# Altium schematic sheet uC_Essentials.SchDoc
size A4; SheetNumber: 5; SheetTotal: 13
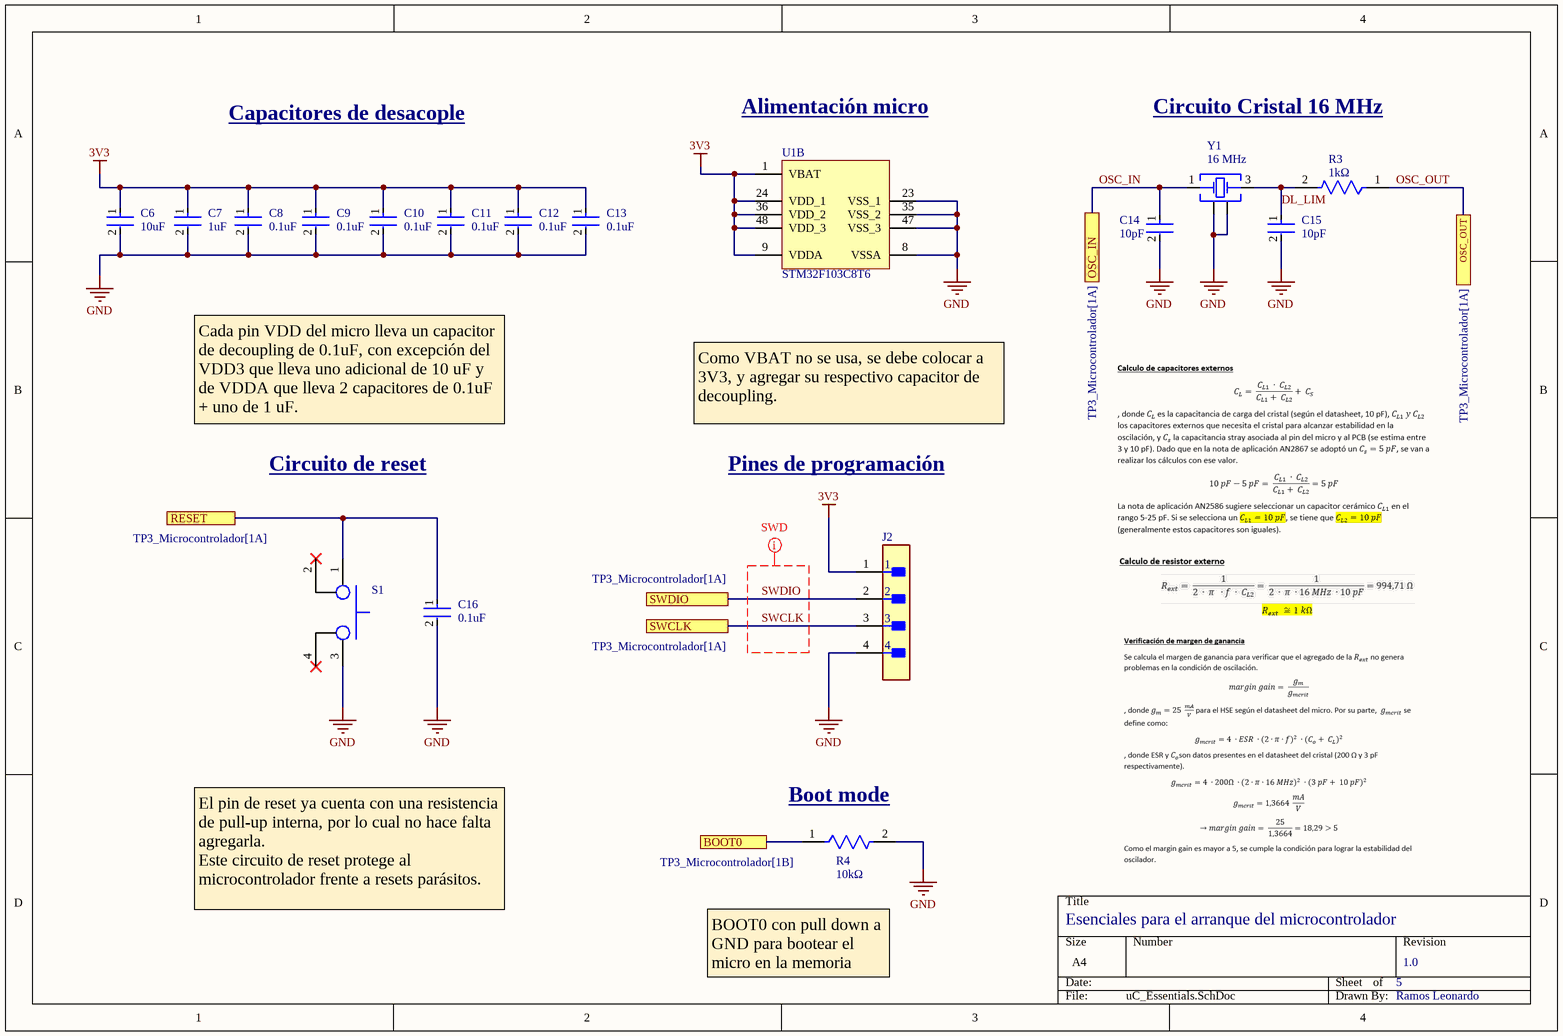
[diagram p0: uC_Essentials.SchDoc]

## Parts
C6  value 10uF  [FP-CC0805-0_85-MFG]  (hidden comment: CC0805KRX7R8BB104)
C7  value 1uF  [FP-CC0805-0_85-MFG]  (hidden comment: CC0805KRX7R8BB104)
C8  value 0.1uF  [FP-CC0805-0_85-MFG]  (hidden comment: CC0805KRX7R8BB104)
C9  value 0.1uF  [FP-CC0805-0_85-MFG]  (hidden comment: CC0805KRX7R8BB104)
C10  value 0.1uF  [FP-CC0805-0_85-MFG]  (hidden comment: CC0805KRX7R8BB104)
C11  value 0.1uF  [FP-CC0805-0_85-MFG]  (hidden comment: CC0805KRX7R8BB104)
C12  value 0.1uF  [FP-CC0805-0_85-MFG]  (hidden comment: CC0805KRX7R8BB104)
C13  value 0.1uF  [FP-CC0805-0_85-MFG]  (hidden comment: CC0805KRX7R8BB104)
C14  value 10pF  [FP-CC0805-0_85-MFG]  (hidden comment: CC0805KRX7R8BB104)
C15  value 10pF  [FP-CC0805-0_85-MFG]  (hidden comment: CC0805KRX7R8BB104)
C16  value 0.1uF  [FP-CC0805-0_85-MFG]  (hidden comment: CC0805KRX7R8BB104)
J2  HTSW-104-07-G-S  [FP-HTSW-104-07-G-S-MFG]  (value not drawn)
R3  Resistance: 1kΩ  [FP-CRCW0805-e3-IPC_B]  (hidden comment: CRCW08054K70JNEA)
R4  Resistance: 10kΩ  [FP-CRCW0805-e3-IPC_B]  (hidden comment: CRCW08054K70JNEA)
S1  Tactile push button  [FP-B3W-1000-MFG]  (value not drawn)
U1  STM32F103C8T6  [STM-LQFP48_L]  (part B of 2)
Y1  16 MHz  [WE-XTAL_IQXC-42]

## Ports
BOOT0 (see TP3_Microcontrolador[1B]), OSC_IN (see TP3_Microcontrolador[1A]), OSC_OUT (see TP3_Microcontrolador[1A]), RESET (see TP3_Microcontrolador[1A]), SWCLK (see TP3_Microcontrolador[1A]), SWDIO (see TP3_Microcontrolador[1A])

## Nets
3V3: C6.1 C7.1 C8.1 C9.1 C10.1 C11.1 C12.1 C13.1 J2.1 U1.1(VBAT) U1.9(VDDA) U1.24(VDD_1) U1.36(VDD_2) U1.48(VDD_3)
GND: C6.2 C7.2 C8.2 C9.2 C10.2 C11.2 C12.2 C13.2 C14.2 C15.2 C16.2 J2.4 R4.2 S1.3 U1.8(VSSA) U1.23(VSS_1) U1.35(VSS_2) U1.47(VSS_3) Y1.2(GND) Y1.4(GND)
BOOT0: R4.1 ; port BOOT0
DL_LIM: C15.1 R3.2 Y1.3(Crystal)
OSC_IN: C14.1 Y1.1(Crystal) ; port OSC_IN
OSC_OUT: R3.1 ; port OSC_OUT
RESET: C16.1 S1.1 ; port RESET
SWCLK: J2.3 ; port SWCLK
SWDIO: J2.2 ; port SWDIO

Not connected (* = marked no-connect by the designer): S1 2* 4*

## Layout directives
net class SWD: SWCLK, SWDIO

## Notes on the sheet
- Alimentación micro
- Circuito Cristal 16 MHz
- Capacitores de desacople
- Cada pin VDD del micro lleva un capacitor de decoupling de 0.1uF, con excepción del VDD3 que lleva uno adicional de 10 uF y de VDDA que lleva 2 capacitores de 0.1uF + uno de 1 uF.
- Como VBAT no se usa, se debe colocar a 3V3, y agregar su respectivo capacitor de decoupling.
- Circuito de reset
- Pines de programación
- (near R4) Boot mode
- El pin de reset ya cuenta con una resistencia de pull-up interna, por lo cual no hace falta agregarla.
  Este circuito de reset protege al microcontrolador frente a resets parásitos.
- Esenciales para el arranque del microcontrolador
- BOOT0 con pull down a GND para bootear el micro en la memoria flash principal.
- 5
- 1.0
- Ramos Leonardo

## Library data of the parts
C6 = CMP-1036-04410-2: CAP CER 4.7UF 25V X7R 0805; Manufacturer: Yageo; Tolerance: 0.1; Material: Ceramic; ComponentLink2URL: http://www.yageo.com/documents/recent/UPY-GPHC_Y5V_6.3V-to-50V_8.pdf; Category: Cap; Mouser Description: Multilayer Ceramic Capacitors MLCC - SMD/SMT 100nF 25V X7R 10%; Manufacturer Part Number: CC0805KRX7R8BB104; Device Class L1: Passive Components; Footprint Url: http://www.yageo.com/exep/pages/download/literatures/UPY-C_GEN_24.pdf; Height: 0.95mm; Digikey Description: CAP CER 0.1UF 25V X7R 0805; Lead Free: Yes; Temperature Range High: +85°C; Temperature: -30°C to +85°C; Ipc Land Pattern Name: CAPC200125X85; Capacitance: 10uF; Automotive: No; Octopart: https://octopart.com/cc0805krx7r8bb104-yageo-39467766; Device Class L2: Capacitors; Temperature Characteristic: X7R; Voltage Rating: 25 V; ComponentLink2Description: Datasheet; Temperature Range Low: -30°C; Device Class L3: Ceramic Capacitors; RoHS: TRUE; Package: CC0805-0.85
C7 = CMP-1036-04410-2: CAP CER 1UF 25V X7R 0805; Manufacturer: Yageo; Tolerance: 0.1; Material: Ceramic; ComponentLink2URL: http://www.yageo.com/documents/recent/UPY-GPHC_Y5V_6.3V-to-50V_8.pdf; Category: Cap; Mouser Description: Multilayer Ceramic Capacitors MLCC - SMD/SMT 100nF 25V X7R 10%; Manufacturer Part Number: CC0805KRX7R8BB104; Device Class L1: Passive Components; Footprint Url: http://www.yageo.com/exep/pages/download/literatures/UPY-C_GEN_24.pdf; Height: 0.95mm; Digikey Description: CAP CER 0.1UF 25V X7R 0805; Lead Free: Yes; Temperature Range High: +85°C; Temperature: -30°C to +85°C; Ipc Land Pattern Name: CAPC200125X85; Capacitance: 1uF; Automotive: No; Octopart: https://octopart.com/cc0805krx7r8bb104-yageo-39467766; Device Class L2: Capacitors; Temperature Characteristic: X7R; Voltage Rating: 25 V; ComponentLink2Description: Datasheet; Temperature Range Low: -30°C; Device Class L3: Ceramic Capacitors; RoHS: TRUE; Package: CC0805-0.85
C8-C13 C16 = CMP-1036-04410-2: CAP CER 0.1UF 25V X7R 0805; Manufacturer: Yageo; Tolerance: 0.1; Material: Ceramic; Capacitance: 100 nF; ComponentLink2URL: http://www.yageo.com/documents/recent/UPY-GPHC_Y5V_6.3V-to-50V_8.pdf; Category: Cap; Mouser Description: Multilayer Ceramic Capacitors MLCC - SMD/SMT 100nF 25V X7R 10%; Manufacturer Part Number: CC0805KRX7R8BB104; Device Class L1: Passive Components; Footprint Url: http://www.yageo.com/exep/pages/download/literatures/UPY-C_GEN_24.pdf; Height: 0.95mm; Digikey Description: CAP CER 0.1UF 25V X7R 0805; Lead Free: Yes; Temperature Range High: +85°C; Temperature: -30°C to +85°C; Ipc Land Pattern Name: CAPC200125X85; Automotive: No; Octopart: https://octopart.com/cc0805krx7r8bb104-yageo-39467766; Device Class L2: Capacitors; Temperature Characteristic: X7R; Voltage Rating: 25 V; ComponentLink2Description: Datasheet; Temperature Range Low: -30°C; Device Class L3: Ceramic Capacitors; RoHS: TRUE; Package: CC0805-0.85
C14 C15 = CMP-1036-04410-2: CAP CER 10pF 25V X7R 0805; Manufacturer: Yageo; Tolerance: 0.1; Material: Ceramic; ComponentLink2URL: http://www.yageo.com/documents/recent/UPY-GPHC_Y5V_6.3V-to-50V_8.pdf; Category: Cap; Mouser Description: Multilayer Ceramic Capacitors MLCC - SMD/SMT 100nF 25V X7R 10%; Manufacturer Part Number: CC0805KRX7R8BB104; Device Class L1: Passive Components; Footprint Url: http://www.yageo.com/exep/pages/download/literatures/UPY-C_GEN_24.pdf; Height: 0.95mm; Digikey Description: CAP CER 0.1UF 25V X7R 0805; Lead Free: Yes; Temperature Range High: +85°C; Temperature: -30°C to +85°C; Ipc Land Pattern Name: CAPC200125X85; Capacitance: 10pF; Automotive: No; Octopart: https://octopart.com/cc0805krx7r8bb104-yageo-39467766; Device Class L2: Capacitors; Temperature Characteristic: X7R; Voltage Rating: 25 V; ComponentLink2Description: Datasheet; Temperature Range Low: -30°C; Device Class L3: Ceramic Capacitors; RoHS: TRUE; Package: CC0805-0.85
J2 = CMP-02766-001776-1: CONN HEADER VERT 4POS 2.54MM; Gender: Male; Number of Contacts: 4; Packaging: Bulk; RoHS Compliant: Yes; Number of Rows: 1; Mount: Through Hole; Contact Material: Bronze; Series: HTSW; Radiation Hardening: No; Pitch: 2.54mm; Reach SVHC Compliant: Yes; Contact Plating: Gold; Termination: Through Hole
R3 = CMP-2001-03967-2: RES Thick Film, 1kΩ, 5%, 0.125W, 200ppm/°C, 0805; Power Rating: 125mW; Voltage Rating: 150V; Radiation Hardening: No; Case Code (Imperial): 0805; Military Standard: Not; Contact Plating: Tin; Weight: 0.000194oz; Mount: Surface Mount; Termination: SMD/SMT; Packaging: Tape and Reel; Min Operating Temperature: -55°C; Width: 1.25mm; Tolerance: 5%; Height: 0.45mm; Depth: 1.25mm; Length: 2mm; Temperature Coefficient: 200ppm/°C; Case Code (Metric): 2012; Package Quantity: 5000; Max Operating Temperature: 155°C; Case/Package: 0805; Composition: Thick Film
R4 = CMP-2001-03967-2: RES Thick Film, 5%, 0.125W, 200ppm/°C, 0805; Power Rating: 125mW; Voltage Rating: 150V; Radiation Hardening: No; Case Code (Imperial): 0805; Military Standard: Not; Contact Plating: Tin; Weight: 0.000194oz; Mount: Surface Mount; Termination: SMD/SMT; Packaging: Tape and Reel; Min Operating Temperature: -55°C; Width: 1.25mm; Tolerance: 5%; Height: 0.45mm; Depth: 1.25mm; Length: 2mm; Temperature Coefficient: 200ppm/°C; Case Code (Metric): 2012; Package Quantity: 5000; Max Operating Temperature: 155°C; Case/Package: 0805; Composition: Thick Film
U1 = CMP-0237-00215-3: ARM Cortex-M3 32-bit MCU, 64 KB Flash, 20 KB Internal RAM, 37 I/Os, 48-pin LQFP, -40 to 85 degC, Tray; Supply Voltage(Vcc) min (V): 2; Internal RAM Size (kB): 20; FLASH Size (Prog) (kB): 64; A/D Converter: 2x12-bit (10 Channel); I/Os (High Current): 37; Operating Frequency(F) (Processor speed) (MHz): 72; Core: ARM Cortex-M3; ComponentLink3Description: Package Specification; Mounting Technology: Surface Mount; PartNumber: STM32F103C8T6; PackageReference: LQFP48; Packing: Tray; ComponentLink3URL: http://www.st.com/st-web-ui/static/active/en/resource/technical/document/datasheet/DM00058181.pdf; DatasheetVersion: Rev. 16; ComponentLink1URL: http://www.st.com/web/en/home.html; PackageVersion: Rev. 6, 06/2013; ComponentLink2URL: http://www.st.com/st-web-ui/static/active/en/resource/technical/document/datasheet/CD00161566.pdf; ComponentLink1Description: Manufacturer URL; ComponentLink2Description: Datasheet; PackageDescription: 48-Pin Low Profile Quad Flat Package, 7 x 7 mm Body, 0.5 mm Pitch
Y1 = CMP-03913-116855783-1: 830108288709 WE-XTAL Quartz Crystal; Frequency: 16MHz; Width: 1.6mm; Length: 2mm; Max Operating Temperature: 105°C; NexarPartId: 116855783; Min Operating Temperature: -40°C; Height: 500µm